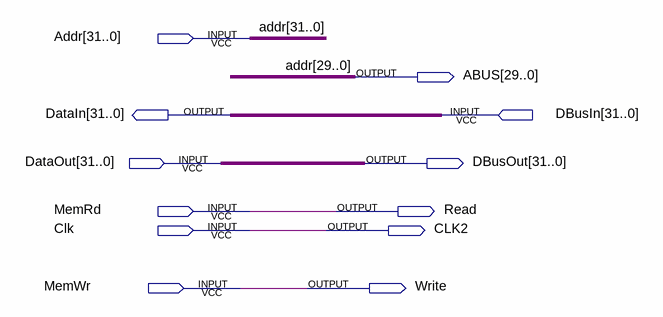
[diagram p0: schematic sheet]
// Quartus schematic DBIU.bdf as structural Verilog: 0 symbols, 12 pins
module DBIU (
  input  [31:0] Addr,
  input  [31:0] DBusIn,
  input  [31:0] DataOut,
  input  MemRd,
  input  Clk,
  input  MemWr,
  output [29:0] ABUS,
  output [31:0] DataIn,
  output [31:0] DBusOut,
  output Read,
  output CLK2,
  output Write
);


  assign ABUS = Addr[29:0];
  assign CLK2 = Clk;
  assign DataIn = DBusIn;
  assign DBusOut = DataOut;
  assign Read = MemRd;
  assign Write = MemWr;
endmodule
